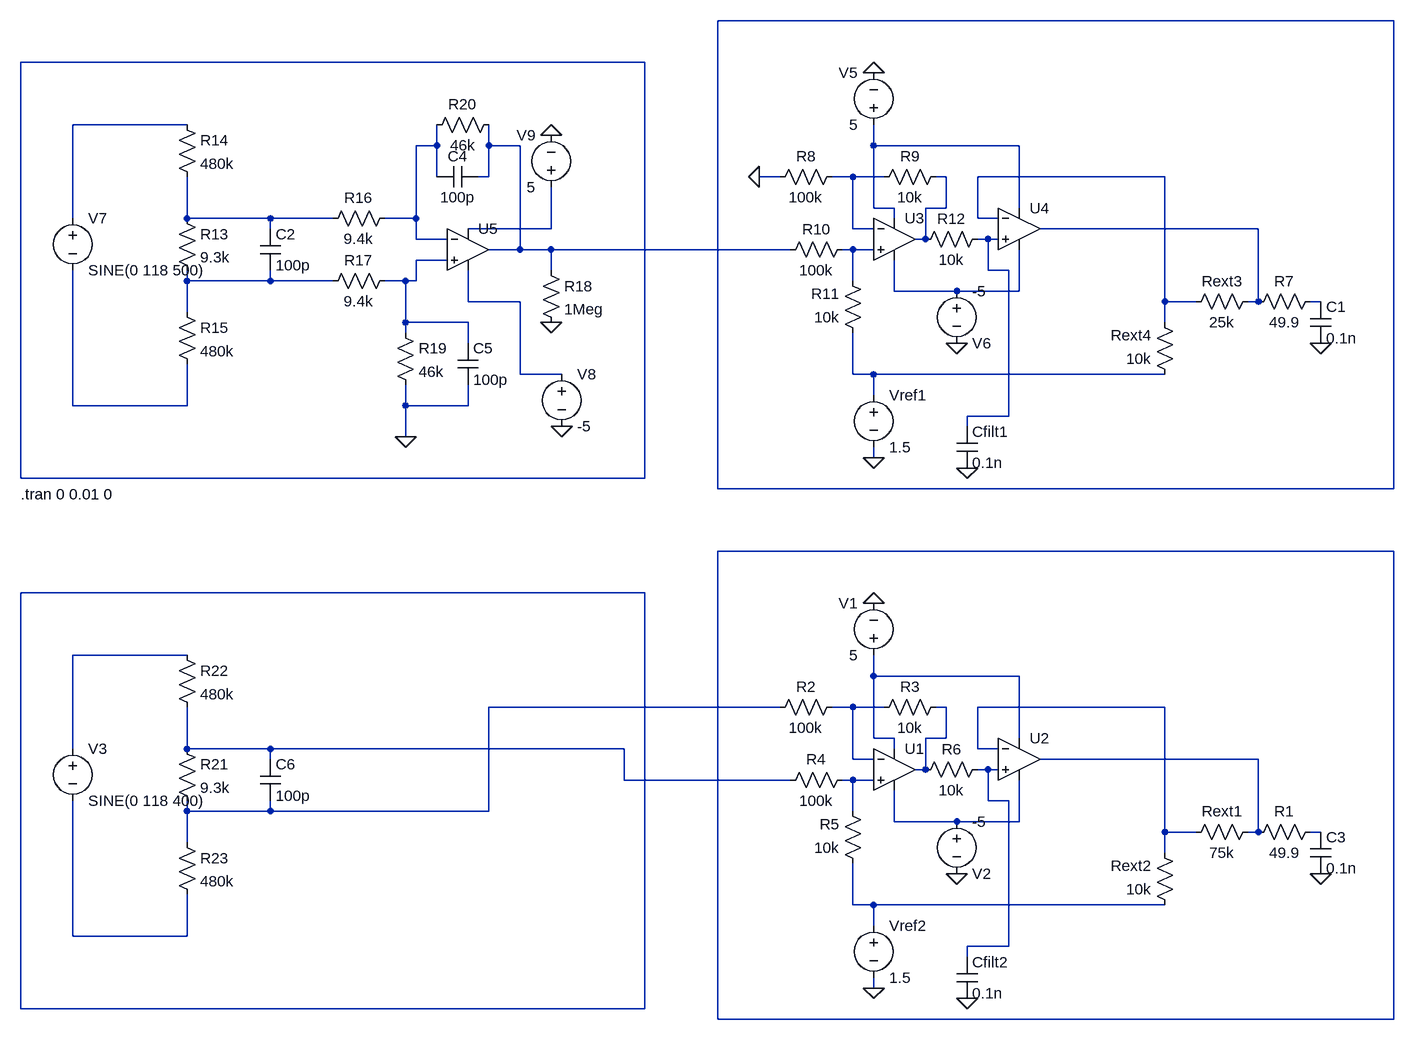
[diagram p0: schematic adc_level_shift.asc]
adc_level_shift.asc, the LTspice schematic file:
Version 4
SHEET 1 2512 2104
WIRE 560 544 -480 544
WIRE -592 608 -1552 608
WIRE -1296 704 -1472 704
WIRE -912 736 -912 704
WIRE -912 736 -944 736
WIRE -832 736 -832 704
WIRE -784 736 -832 736
WIRE -240 736 -240 704
WIRE -16 736 -240 736
WIRE -912 784 -912 736
WIRE -832 784 -832 736
WIRE -832 784 -848 784
WIRE -384 784 -416 784
WIRE -272 784 -304 784
WIRE -224 784 -272 784
WIRE -128 784 -144 784
WIRE 208 784 -80 784
WIRE -240 832 -240 736
WIRE -208 832 -240 832
WIRE -128 832 -128 784
WIRE -128 832 -160 832
WIRE -16 832 -16 736
WIRE -1472 848 -1472 704
WIRE -1296 848 -1296 784
WIRE -1168 848 -1296 848
WIRE -1072 848 -1168 848
WIRE -944 848 -944 736
WIRE -944 848 -992 848
WIRE -208 848 -208 832
WIRE -80 848 -80 784
WIRE -48 848 -80 848
WIRE -1168 864 -1168 848
WIRE -736 864 -736 800
WIRE -736 864 -864 864
WIRE -272 864 -272 784
WIRE -240 864 -272 864
WIRE 352 864 16 864
WIRE -944 880 -944 848
WIRE -896 880 -944 880
WIRE -160 880 -160 832
WIRE -160 880 -176 880
WIRE -64 880 -80 880
WIRE -48 880 -64 880
WIRE -784 896 -784 736
WIRE -784 896 -832 896
WIRE -736 896 -784 896
WIRE -368 896 -736 896
WIRE -272 896 -288 896
WIRE -240 896 -272 896
WIRE -896 912 -944 912
WIRE -736 928 -736 896
WIRE -64 928 -64 880
WIRE -32 928 -64 928
WIRE -1296 944 -1296 928
WIRE -1168 944 -1168 928
WIRE -1168 944 -1296 944
WIRE -1072 944 -1168 944
WIRE -960 944 -992 944
WIRE -944 944 -944 912
WIRE -944 944 -960 944
WIRE -272 944 -272 896
WIRE -208 960 -208 912
WIRE -112 960 -208 960
WIRE -16 960 -16 896
WIRE -16 960 -112 960
WIRE -864 976 -864 928
WIRE -784 976 -864 976
WIRE 208 976 208 784
WIRE 256 976 208 976
WIRE 352 976 352 864
WIRE 352 976 336 976
WIRE 448 976 432 976
WIRE -1296 992 -1296 944
WIRE -960 1008 -960 944
WIRE -864 1008 -960 1008
WIRE 208 1008 208 976
WIRE -960 1024 -960 1008
WIRE -864 1040 -864 1008
WIRE -784 1088 -784 976
WIRE -720 1088 -784 1088
WIRE -272 1088 -272 1024
WIRE -240 1088 -272 1088
WIRE 208 1088 -240 1088
WIRE -240 1120 -240 1088
WIRE -1472 1136 -1472 928
WIRE -1296 1136 -1296 1072
WIRE -1296 1136 -1472 1136
WIRE -960 1136 -960 1104
WIRE -864 1136 -864 1104
WIRE -864 1136 -960 1136
WIRE -32 1152 -32 928
WIRE -32 1152 -96 1152
WIRE -96 1168 -96 1152
WIRE -960 1184 -960 1136
WIRE -240 1216 -240 1200
WIRE -1552 1248 -1552 608
WIRE -592 1248 -592 608
WIRE -592 1248 -1552 1248
WIRE -480 1264 -480 544
WIRE 560 1264 560 544
WIRE 560 1264 -480 1264
WIRE 560 1360 -480 1360
WIRE -592 1424 -1552 1424
WIRE -1296 1520 -1472 1520
WIRE -240 1552 -240 1520
WIRE -16 1552 -240 1552
WIRE -384 1600 -832 1600
WIRE -272 1600 -304 1600
WIRE -224 1600 -272 1600
WIRE -128 1600 -144 1600
WIRE 208 1600 -80 1600
WIRE -240 1648 -240 1552
WIRE -208 1648 -240 1648
WIRE -128 1648 -128 1600
WIRE -128 1648 -160 1648
WIRE -16 1648 -16 1552
WIRE -1472 1664 -1472 1520
WIRE -1296 1664 -1296 1600
WIRE -1168 1664 -1296 1664
WIRE -624 1664 -1168 1664
WIRE -208 1664 -208 1648
WIRE -80 1664 -80 1600
WIRE -48 1664 -80 1664
WIRE -1168 1680 -1168 1664
WIRE -272 1680 -272 1600
WIRE -240 1680 -272 1680
WIRE 352 1680 16 1680
WIRE -160 1696 -160 1648
WIRE -160 1696 -176 1696
WIRE -64 1696 -80 1696
WIRE -48 1696 -64 1696
WIRE -624 1712 -624 1664
WIRE -368 1712 -624 1712
WIRE -272 1712 -288 1712
WIRE -240 1712 -272 1712
WIRE -64 1744 -64 1696
WIRE -32 1744 -64 1744
WIRE -1296 1760 -1296 1744
WIRE -1168 1760 -1168 1744
WIRE -1168 1760 -1296 1760
WIRE -832 1760 -832 1600
WIRE -832 1760 -1168 1760
WIRE -272 1760 -272 1712
WIRE -208 1776 -208 1728
WIRE -112 1776 -208 1776
WIRE -16 1776 -16 1712
WIRE -16 1776 -112 1776
WIRE 208 1792 208 1600
WIRE 256 1792 208 1792
WIRE 352 1792 352 1680
WIRE 352 1792 336 1792
WIRE 448 1792 432 1792
WIRE -1296 1808 -1296 1760
WIRE 208 1824 208 1792
WIRE -272 1904 -272 1840
WIRE -240 1904 -272 1904
WIRE 208 1904 -240 1904
WIRE -240 1936 -240 1904
WIRE -1472 1952 -1472 1744
WIRE -1296 1952 -1296 1888
WIRE -1296 1952 -1472 1952
WIRE -32 1968 -32 1744
WIRE -32 1968 -96 1968
WIRE -96 1984 -96 1968
WIRE -240 2032 -240 2016
WIRE -1552 2064 -1552 1424
WIRE -592 2064 -592 1424
WIRE -592 2064 -1552 2064
WIRE -480 2080 -480 1360
WIRE 560 2080 560 1360
WIRE 560 2080 -480 2080
FLAG -240 1216 0
FLAG 448 1040 0
FLAG -96 1232 0
FLAG -112 1040 0
FLAG -240 624 0
FLAG -416 784 0
FLAG -736 1008 0
FLAG -960 1184 0
FLAG -720 1168 0
FLAG -736 720 0
FLAG -240 2032 0
FLAG 448 1856 0
FLAG -96 2048 0
FLAG -112 1856 0
FLAG -240 1440 0
SYMBOL cap 432 976 R0
SYMATTR InstName C1
SYMATTR Value 0.1n
SYMBOL res 352 960 R90
WINDOW 0 0 56 VBottom 2
WINDOW 3 32 56 VTop 2
SYMATTR InstName Rext3
SYMATTR Value 25k
SYMBOL res 224 1104 R180
WINDOW 0 36 76 Left 2
WINDOW 3 36 40 Left 2
SYMATTR InstName Rext4
SYMATTR Value 10k
SYMBOL cap -112 1168 R0
SYMATTR InstName Cfilt1
SYMATTR Value 0.1n
SYMBOL voltage -240 1104 R0
WINDOW 123 0 0 Left 0
WINDOW 39 0 0 Left 0
SYMATTR InstName Vref1
SYMATTR Value 1.5
SYMBOL res 448 960 R90
WINDOW 0 0 56 VBottom 2
WINDOW 3 32 56 VTop 2
SYMATTR InstName R7
SYMATTR Value 49.9
SYMBOL res -288 768 R90
WINDOW 0 0 56 VBottom 2
WINDOW 3 32 56 VTop 2
SYMATTR InstName R8
SYMATTR Value 100k
SYMBOL res -128 768 R90
WINDOW 0 0 56 VBottom 2
WINDOW 3 32 56 VTop 2
SYMATTR InstName R9
SYMATTR Value 10k
SYMBOL res -272 880 R90
WINDOW 0 0 56 VBottom 2
WINDOW 3 32 56 VTop 2
SYMATTR InstName R10
SYMATTR Value 100k
SYMBOL res -256 1040 R180
WINDOW 0 36 76 Left 2
WINDOW 3 36 40 Left 2
SYMATTR InstName R11
SYMATTR Value 10k
SYMBOL res -64 864 R90
WINDOW 0 0 56 VBottom 2
WINDOW 3 32 56 VTop 2
SYMATTR InstName R12
SYMATTR Value 10k
SYMBOL voltage -240 720 R180
WINDOW 0 24 96 Left 2
WINDOW 3 24 16 Left 2
WINDOW 123 0 0 Left 0
WINDOW 39 0 0 Left 0
SYMATTR InstName V5
SYMATTR Value 5
SYMBOL voltage -112 944 R0
WINDOW 0 24 96 Left 2
WINDOW 3 24 16 Left 2
WINDOW 123 0 0 Left 0
WINDOW 39 0 0 Left 0
SYMATTR InstName V6
SYMATTR Value -5
SYMBOL Opamps\\UniversalOpamp2 -208 880 R0
SYMATTR InstName U3
SYMBOL Opamps\\UniversalOpamp2 -16 864 R0
SYMATTR InstName U4
SYMBOL voltage -1472 832 R0
WINDOW 123 0 0 Left 0
WINDOW 39 0 0 Left 0
SYMATTR InstName V7
SYMATTR Value SINE(0 118 500)
SYMBOL res -1312 832 R0
SYMATTR InstName R13
SYMATTR Value 9.3k
SYMBOL res -1312 688 R0
SYMATTR InstName R14
SYMATTR Value 480k
SYMBOL res -1312 976 R0
SYMATTR InstName R15
SYMATTR Value 480k
SYMBOL cap -1184 864 R0
SYMATTR InstName C2
SYMATTR Value 100p
SYMBOL res -976 832 R90
WINDOW 0 0 56 VBottom 2
WINDOW 3 32 56 VTop 2
SYMATTR InstName R16
SYMATTR Value 9.4k
SYMBOL res -976 928 R90
WINDOW 0 0 56 VBottom 2
WINDOW 3 32 56 VTop 2
SYMATTR InstName R17
SYMATTR Value 9.4k
SYMBOL Opamps\\UniversalOpamp2 -864 896 R0
SYMATTR InstName U5
SYMBOL res -752 912 R0
SYMATTR InstName R18
SYMATTR Value 1Meg
SYMBOL res -976 1008 R0
SYMATTR InstName R19
SYMATTR Value 46k
SYMBOL res -816 688 R90
WINDOW 0 0 56 VBottom 2
WINDOW 3 32 56 VTop 2
SYMATTR InstName R20
SYMATTR Value 46k
SYMBOL cap -848 768 R90
WINDOW 0 0 32 VBottom 2
WINDOW 3 32 32 VTop 2
SYMATTR InstName C4
SYMATTR Value 100p
SYMBOL cap -880 1040 R0
SYMATTR InstName C5
SYMATTR Value 100p
SYMBOL voltage -720 1072 R0
WINDOW 123 0 0 Left 0
WINDOW 39 0 0 Left 0
SYMATTR InstName V8
SYMATTR Value -5
SYMBOL voltage -736 816 R180
WINDOW 0 24 96 Left 2
WINDOW 3 24 16 Left 2
WINDOW 123 0 0 Left 0
WINDOW 39 0 0 Left 0
SYMATTR InstName V9
SYMATTR Value 5
SYMBOL cap 432 1792 R0
SYMATTR InstName C3
SYMATTR Value 0.1n
SYMBOL res 352 1776 R90
WINDOW 0 0 56 VBottom 2
WINDOW 3 32 56 VTop 2
SYMATTR InstName Rext1
SYMATTR Value 75k
SYMBOL res 224 1920 R180
WINDOW 0 36 76 Left 2
WINDOW 3 36 40 Left 2
SYMATTR InstName Rext2
SYMATTR Value 10k
SYMBOL cap -112 1984 R0
SYMATTR InstName Cfilt2
SYMATTR Value 0.1n
SYMBOL voltage -240 1920 R0
WINDOW 123 0 0 Left 0
WINDOW 39 0 0 Left 0
SYMATTR InstName Vref2
SYMATTR Value 1.5
SYMBOL res 448 1776 R90
WINDOW 0 0 56 VBottom 2
WINDOW 3 32 56 VTop 2
SYMATTR InstName R1
SYMATTR Value 49.9
SYMBOL res -288 1584 R90
WINDOW 0 0 56 VBottom 2
WINDOW 3 32 56 VTop 2
SYMATTR InstName R2
SYMATTR Value 100k
SYMBOL res -128 1584 R90
WINDOW 0 0 56 VBottom 2
WINDOW 3 32 56 VTop 2
SYMATTR InstName R3
SYMATTR Value 10k
SYMBOL res -272 1696 R90
WINDOW 0 0 56 VBottom 2
WINDOW 3 32 56 VTop 2
SYMATTR InstName R4
SYMATTR Value 100k
SYMBOL res -256 1856 R180
WINDOW 0 36 76 Left 2
WINDOW 3 36 40 Left 2
SYMATTR InstName R5
SYMATTR Value 10k
SYMBOL res -64 1680 R90
WINDOW 0 0 56 VBottom 2
WINDOW 3 32 56 VTop 2
SYMATTR InstName R6
SYMATTR Value 10k
SYMBOL voltage -240 1536 R180
WINDOW 0 24 96 Left 2
WINDOW 3 24 16 Left 2
WINDOW 123 0 0 Left 0
WINDOW 39 0 0 Left 0
SYMATTR InstName V1
SYMATTR Value 5
SYMBOL voltage -112 1760 R0
WINDOW 0 24 96 Left 2
WINDOW 3 24 16 Left 2
WINDOW 123 0 0 Left 0
WINDOW 39 0 0 Left 0
SYMATTR InstName V2
SYMATTR Value -5
SYMBOL Opamps\\UniversalOpamp2 -208 1696 R0
SYMATTR InstName U1
SYMBOL Opamps\\UniversalOpamp2 -16 1680 R0
SYMATTR InstName U2
SYMBOL voltage -1472 1648 R0
WINDOW 123 0 0 Left 0
WINDOW 39 0 0 Left 0
SYMATTR InstName V3
SYMATTR Value SINE(0 118 400)
SYMBOL res -1312 1648 R0
SYMATTR InstName R21
SYMATTR Value 9.3k
SYMBOL res -1312 1504 R0
SYMATTR InstName R22
SYMATTR Value 480k
SYMBOL res -1312 1792 R0
SYMATTR InstName R23
SYMATTR Value 480k
SYMBOL cap -1184 1680 R0
SYMATTR InstName C6
SYMATTR Value 100p
TEXT -1552 1272 Left 2 !.tran 0 0.01 0

The netlist it stands for:
* adc_level_shift.asc
C1 N019 0 0.1n
Rext3 N012 N009 25k
Rext4 N020 N009 10k
Cfilt1 N013 0 0.1n
Vref1 N020 0 1.5
R7 N019 N012 49.9
R8 N007 0 100k
R9 N008 N007 10k
R10 N014 N005 100k
R11 N020 N014 10k
R12 N013 N008 10k
V5 N006 0 5
V6 N017 0 -5
XU3 N014 N007 N006 N017 N008 level.2 Avol=1Meg GBW=10Meg Slew=10Meg ilimit=25m rail=0 Vos=0 phimargin=45 en=0 enk=0 in=0 ink=0 Rin=500Meg  ; pins IN+ IN- V+ V- OUT
XU4 N013 N009 N006 N017 N012 level.2 Avol=1Meg GBW=10Meg Slew=10Meg ilimit=25m rail=0 Vos=0 phimargin=45 en=0 enk=0 in=0 ink=0 Rin=500Meg  ; pins IN+ IN- V+ V- OUT
V7 N003 N021 SINE(0 118 500)
R13 N010 N016 9.3k
R14 N003 N010 480k
R15 N016 N021 480k
C2 N010 N016 100p
R16 N004 N010 9.4k
R17 N015 N016 9.4k
XU5 N015 N004 N011 N018 N005 level.2 Avol=1Meg GBW=10Meg Slew=10Meg ilimit=25m rail=0 Vos=0 phimargin=45 en=0 enk=0 in=0 ink=0 Rin=500Meg  ; pins IN+ IN- V+ V- OUT
R18 N005 0 1Meg
R19 N015 0 46k
R20 N005 N004 46k
C4 N005 N004 100p
C5 N015 0 100p
V8 N018 0 -5
V9 N011 0 5
C3 N035 0 0.1n
Rext1 N031 N029 75k
Rext2 N036 N029 10k
Cfilt2 N032 0 0.1n
Vref2 N036 0 1.5
R1 N035 N031 49.9
R2 N027 N026 100k
R3 N028 N027 10k
R4 N033 N030 100k
R5 N036 N033 10k
R6 N032 N028 10k
V1 N025 0 5
V2 N034 0 -5
XU1 N033 N027 N025 N034 N028 level.2 Avol=1Meg GBW=10Meg Slew=10Meg ilimit=25m rail=0 Vos=0 phimargin=45 en=0 enk=0 in=0 ink=0 Rin=500Meg  ; pins IN+ IN- V+ V- OUT
XU2 N032 N029 N025 N034 N031 level.2 Avol=1Meg GBW=10Meg Slew=10Meg ilimit=25m rail=0 Vos=0 phimargin=45 en=0 enk=0 in=0 ink=0 Rin=500Meg  ; pins IN+ IN- V+ V- OUT
V3 N024 N037 SINE(0 118 400)
R21 N030 N026 9.3k
R22 N024 N030 480k
R23 N026 N037 480k
C6 N030 N026 100p
.tran 0 0.01 0
.lib UniversalOpamps2.sub
.backanno
.end